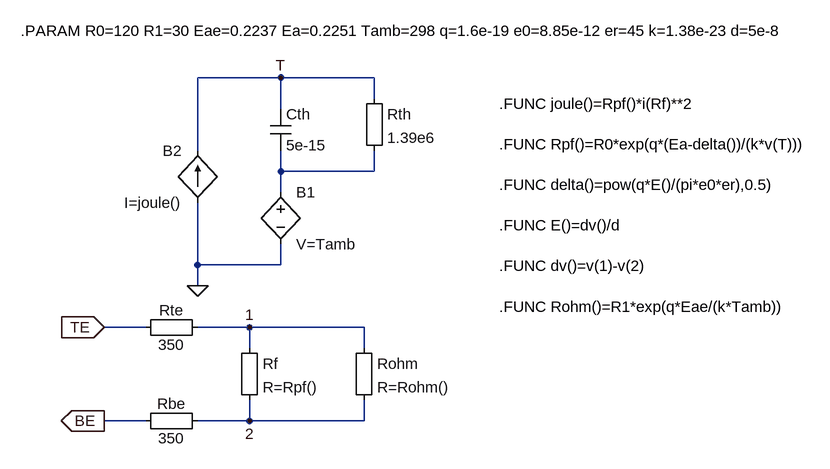
[diagram p0: schematic 神经元拟合.asc]
神经元拟合.asc, the LTspice schematic file:
Version 4
SHEET 1 2180 680
WIRE 304 -288 176 -288
WIRE 448 -288 304 -288
WIRE 448 -256 448 -288
WIRE 304 -240 304 -288
WIRE 176 -176 176 -288
WIRE 304 -144 304 -176
WIRE 448 -144 448 -176
WIRE 448 -144 304 -144
WIRE 304 -112 304 -144
WIRE 176 0 176 -96
WIRE 304 0 304 -32
WIRE 304 0 176 0
WIRE 176 32 176 0
WIRE 96 96 32 96
WIRE 256 96 176 96
WIRE 432 96 256 96
WIRE 256 128 256 96
WIRE 432 128 432 96
WIRE 96 240 32 240
WIRE 256 240 256 208
WIRE 256 240 176 240
WIRE 432 240 432 208
WIRE 432 240 256 240
FLAG 176 32 0
FLAG 304 -288 T
FLAG 256 96 1
FLAG 256 240 2
FLAG 32 96 TE
IOPIN 32 96 In
FLAG 32 240 BE
IOPIN 32 240 Out
SYMBOL cap 288 -240 R0
SYMATTR InstName Cth
SYMATTR Value 5e-15
SYMBOL Misc\\EuropeanResistor 432 -272 R0
SYMATTR InstName Rth
SYMATTR Value 1.39e6
SYMBOL Misc\\EuropeanResistor 240 112 R0
SYMATTR InstName Rf
SYMATTR Value R=Rpf()
SYMBOL Misc\\EuropeanResistor 416 112 R0
SYMATTR InstName Rohm
SYMATTR Value R=Rohm()
SYMBOL Misc\\EuropeanResistor 192 80 R90
WINDOW 0 5 56 VBottom 2
WINDOW 3 27 56 VTop 2
SYMATTR InstName Rte
SYMATTR Value 350
SYMBOL Misc\\EuropeanResistor 192 224 R90
WINDOW 0 5 56 VBottom 2
WINDOW 3 27 56 VTop 2
SYMATTR InstName Rbe
SYMATTR Value 350
SYMBOL bv 304 -128 R0
SYMATTR InstName B1
SYMATTR Value V=Tamb
SYMBOL bi 176 -96 R180
WINDOW 0 24 80 Left 2
WINDOW 3 24 0 Left 2
SYMATTR InstName B2
SYMATTR Value I=joule()
TEXT 640 -248 Left 2 !.FUNC joule()=Rpf()*i(Rf)**2\n \n.FUNC Rpf()=R0*exp(q*(Ea-delta())/(k*v(T)))\n \n.FUNC delta()=pow(q*E()/(pi*e0*er),0.5)\n \n.FUNC E()=dv()/d\n \n.FUNC dv()=v(1)-v(2)\n \n.FUNC Rohm()=R1*exp(q*Eae/(k*Tamb))
TEXT -96 -360 Left 2 !.PARAM R0=120 R1=30 Eae=0.2237 Ea=0.2251 Tamb=298 q=1.6e-19 e0=8.85e-12 er=45 k=1.38e-23 d=5e-8

The netlist it stands for:
* 神经元拟合.asc
Cth T N001 5e-15
Rth T N001 1.39e6
Rf 1 2 R=Rpf()
Rohm 1 2 R=Rohm()
Rte 1 TE 350
Rbe 2 BE 350
B1 N001 0 V=Tamb
B2 0 T I=joule()
.FUNC joule()=Rpf()*i(Rf)**2
.FUNC Rpf()=R0*exp(q*(Ea-delta())/(k*v(T)))
.FUNC delta()=pow(q*E()/(pi*e0*er),0.5)
.FUNC E()=dv()/d
.FUNC dv()=v(1)-v(2)
.FUNC Rohm()=R1*exp(q*Eae/(k*Tamb))
.PARAM R0=120 R1=30 Eae=0.2237 Ea=0.2251 Tamb=298 q=1.6e-19 e0=8.85e-12 er=45 k=1.38e-23 d=5e-8
.backanno
.end